# Altium schematic sheet UWB_Tag.SchDoc
size A3; SheetNumber: 1; SheetTotal: 1
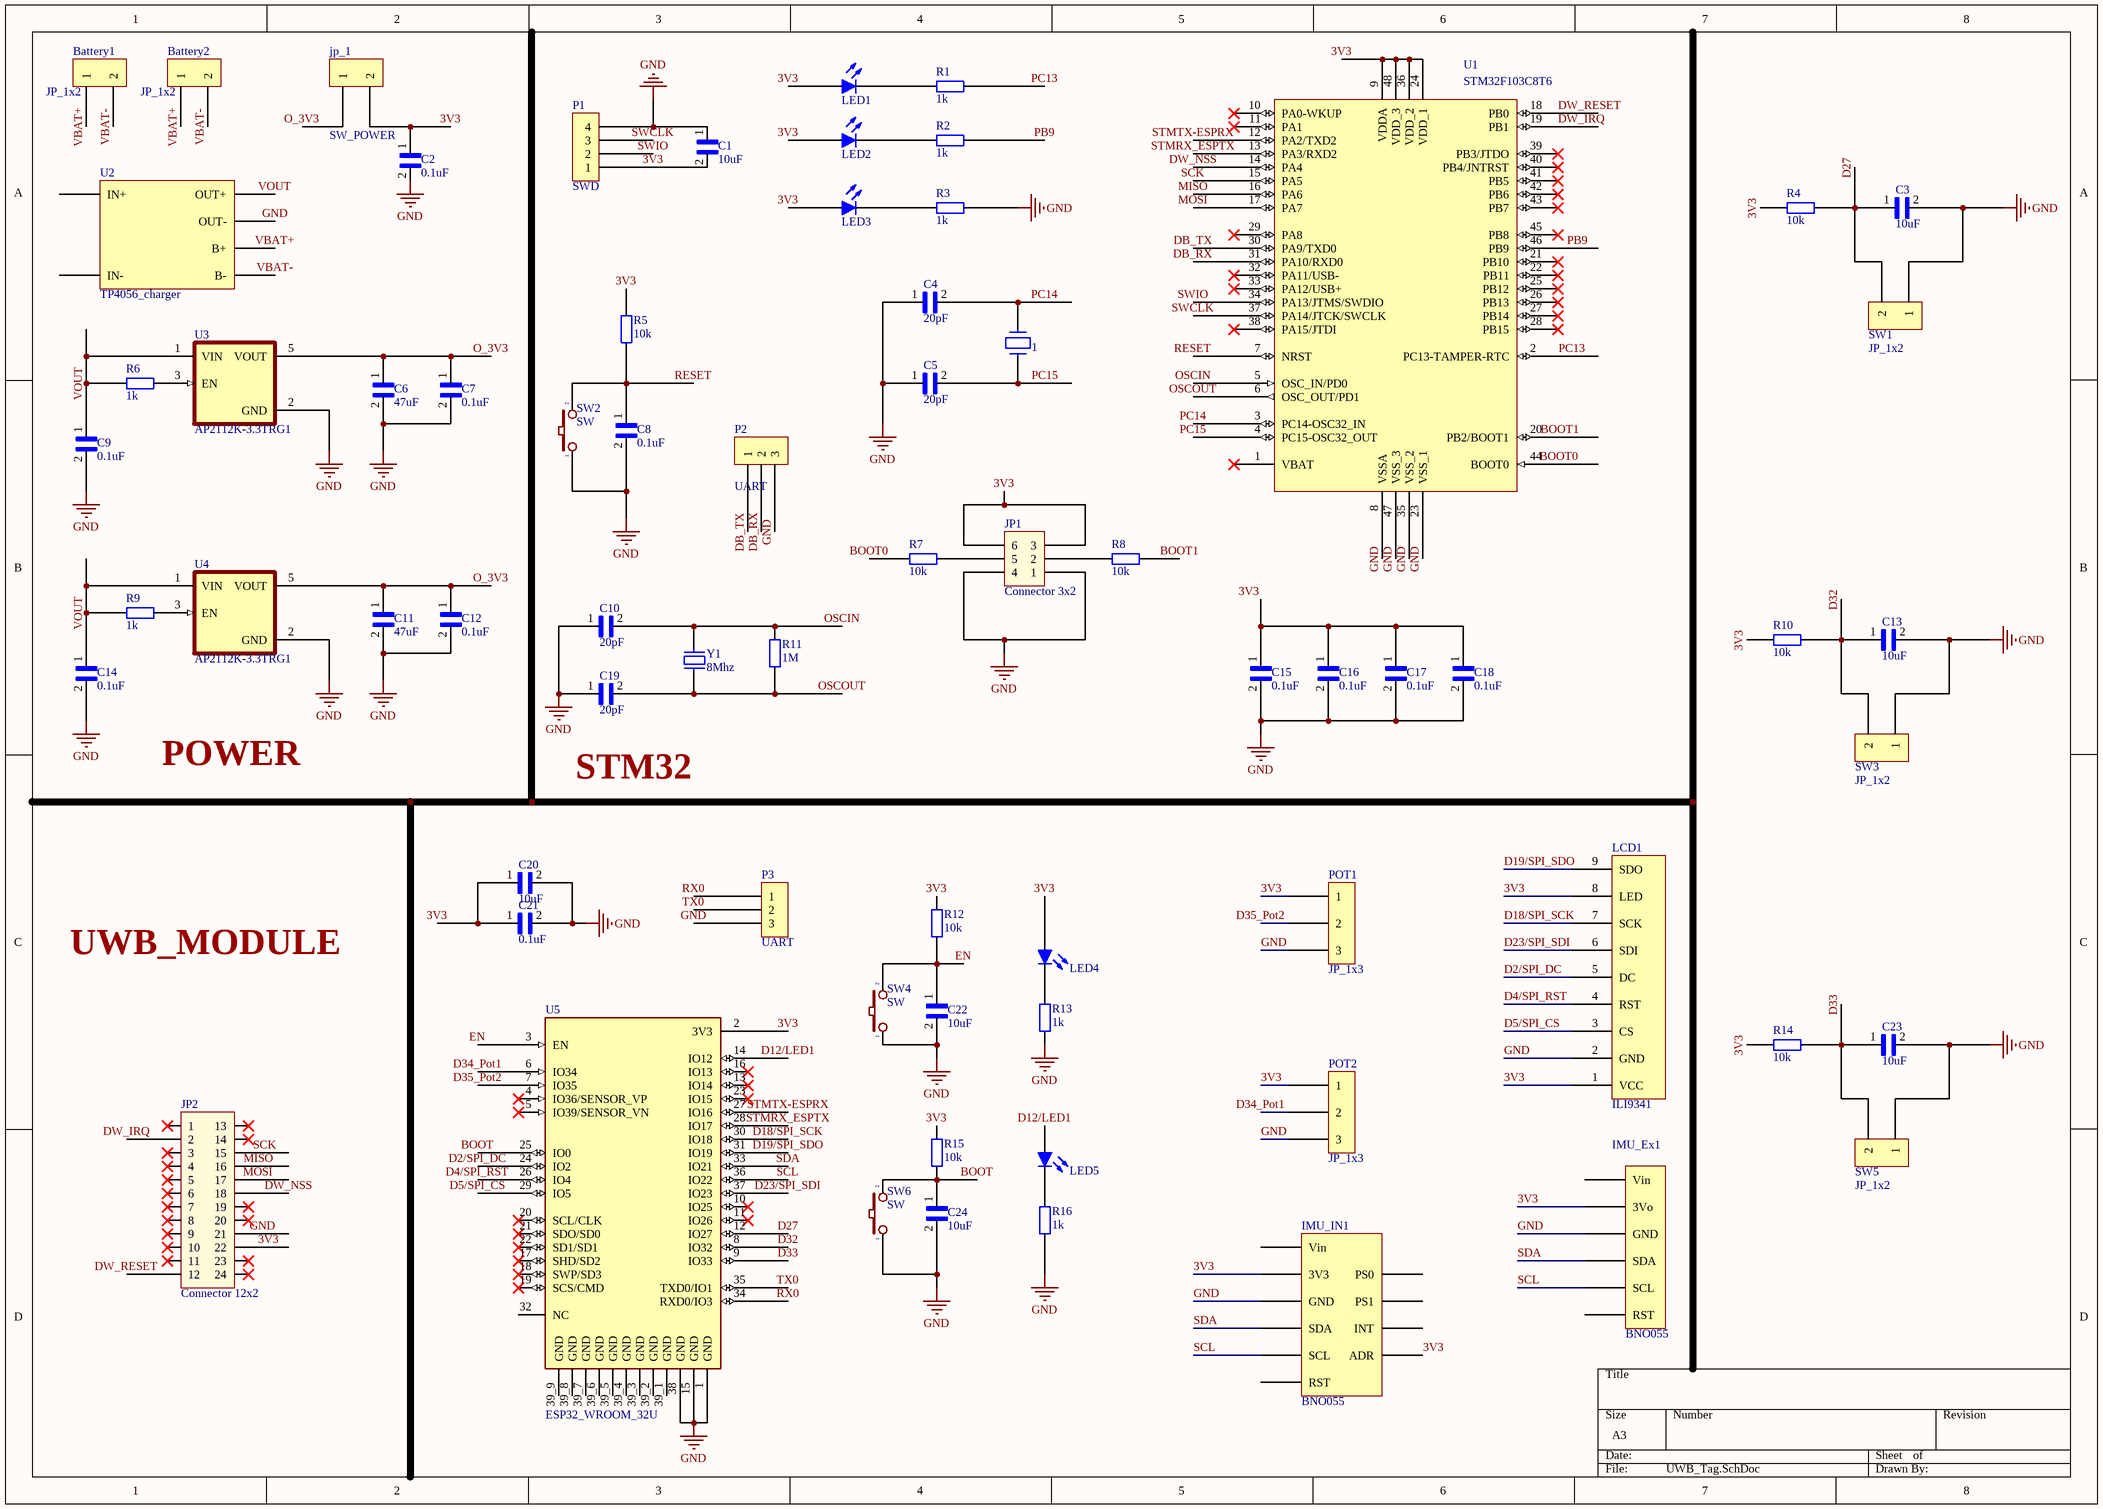
[diagram p0: UWB_Tag.SchDoc]

## Parts
1  ABS07  [ABS07]  (value not drawn)
Battery1  JP_1x2  [JP_1x2]
Battery2  JP_1x2  [JP_1x2]
C1  10uF  [Capacitor_0805]
C2  0.1uF  [Capacitor_0805]
C3  10uF  [Capacitor_0805]
C4  20pF  [Capacitor_0805]
C5  20pF  [Capacitor_0805]
C6  47uF  [Capacitor_0805]
C7  0.1uF  [Capacitor_0805]
C8  0.1uF  [Capacitor_0805]
C9  0.1uF  [Capacitor_0805]
C10  20pF  [Capacitor_0805]
C11  47uF  [Capacitor_0805]
C12  0.1uF  [Capacitor_0805]
C13  10uF  [Capacitor_0805]
C14  0.1uF  [Capacitor_0805]
C15  0.1uF  [Capacitor_0805]
C16  0.1uF  [Capacitor_0805]
C17  0.1uF  [Capacitor_0805]
C18  0.1uF  [Capacitor_0805]
C19  20pF  [Capacitor_0805]
C20  10uF  [Capacitor_0805]
C21  0.1uF  [Capacitor_0805]
C22  10uF  [Capacitor_0805]
C23  10uF  [Capacitor_0805]
C24  10uF  [Capacitor_0805]
IMU_Ex1  BNO055  [BNO055_External]
IMU_IN1  BNO055  [BNO055_Internal]
JP1  Connector 3x2  [JP3x2]
JP2  Connector 12x2  [JP12X2_1]
jp_1  SW_POWER  [JP_1x2]
LCD1  ILI9341  [ILI9341_LCD3.5]
LED1  Led  [Led 0805 Blue]  (value not drawn)
LED2  Led  [Led 0805 Blue]  (value not drawn)
LED3  Led  [Led 0805 Blue]  (value not drawn)
LED4  Led  [Led 0805 Blue]  (value not drawn)
LED5  Led  [Led 0805 Blue]  (value not drawn)
P1  SWD  [HDR/Header/4/BOX]
P2  UART  [HDR/Header/3/BOX]
P3  UART  [HDR/Header/3/BOX]
POT1  JP_1x3  [JP_1x3]
POT2  JP_1x3  [JP_1x3]
R1  1k  [tro smd 0805]
R2  1k  [tro smd 0805]
R3  1k  [tro smd 0805]
R4  10k  [tro smd 0805]
R5  10k  [tro smd 0805]
R6  1k  [tro smd 0805]
R7  10k  [tro smd 0805]
R8  10k  [tro smd 0805]
R9  1k  [tro smd 0805]
R10  10k  [tro smd 0805]
R11  1M  [tro smd 0805]
R12  10k  [tro smd 0805]
R13  1k  [tro smd 0805]
R14  10k  [tro smd 0805]
R15  10k  [tro smd 0805]
R16  1k  [tro smd 0805]
SW1  JP_1x2  [JP_1x2]
SW2  SW  [SW1-SMD]
SW3  JP_1x2  [JP_1x2]
SW4  SW  [SW1-SMD]
SW5  JP_1x2  [JP_1x2]
SW6  SW  [SW1-SMD]
U1  STM32F103C8T6  [LQFP48]
U2  TP4056_charger  [TP4056_charger]
U3  AP2112K-3.3TRG1  [SOT95P285X140-5N]
U4  AP2112K-3.3TRG1  [SOT95P285X140-5N]
U5  ESP32_WROOM_32U  [ESP32_WROOM_32U]
Y1  8Mhz  [Thach Anh 2 chan SMD5032]

## Nets
GND: C1.1 C2.2 C3.2 C4.1 C5.1 C6.2 C7.2 C8.2 C9.2 C10.1 C11.2 C12.2 C13.2 C14.2 C15.2 C16.2 C17.2 C18.2 C19.1 C20.2 C21.2 C22.2 C23.2 C24.2 IMU_Ex1.3(GND) IMU_IN1.3(GND) JP1.1 JP1.4 JP2.21 LCD1.2(GND) P1.4 P2.3 P3.3 POT1.3 POT2.3 R3.2 R13.2 R16.2 SW1.1 SW2.1 SW3.1 SW4.1 SW5.1 SW6.1 U1.8(VSSA) U1.23(VSS_1) U1.35(VSS_2) U1.47(VSS_3) U2.4(OUT-) U3.2(GND) U4.2(GND) U5.1(GND) U5.15(GND) U5.38(GND)
3V3: C1.2 C2.1 C15.1 C16.1 C17.1 C18.1 C20.1 C21.1 IMU_Ex1.2(3Vo) IMU_IN1.2(3V3) IMU_IN1.7(ADR) JP1.3 JP1.6 JP2.22 jp_1.2 LCD1.1(VCC) LCD1.8(LED) LED1.1(A) LED2.1(A) LED3.1(A) LED4.1(A) P1.1 POT1.1 POT2.1 R4.2 R5.2 R10.2 R12.2 R14.2 R15.2 U1.9(VDDA) U1.24(VDD_1) U1.36(VDD_2) U1.48(VDD_3) U5.2(3V3)
BOOT: C24.1 R15.1 SW6.2 U5.25(IO0)
BOOT0: R7.1 U1.44(BOOT0)
BOOT1: R8.2 U1.20(PB2/BOOT1)
D2/SPI_DC: LCD1.5(DC) U5.24(IO2)
D4/SPI_RST: LCD1.4(RST) U5.26(IO4)
D5/SPI_CS: LCD1.3(CS) U5.29(IO5)
D12/LED1: LED5.1(A) U5.14(IO12)
D18/SPI_SCK: LCD1.7(SCK) U5.30(IO18)
D19/SPI_SDO: LCD1.9(SDO) U5.31(IO19)
D23/SPI_SDI: LCD1.6(SDI) U5.37(IO23)
D27: C3.1 R4.1 SW1.2 U5.12(IO27)
D32: C13.1 R10.1 SW3.2 U5.8(IO32)
D33: C23.1 R14.1 SW5.2 U5.9(IO33)
D34_Pot1: POT2.2 U5.6(IO34)
D35_Pot2: POT1.2 U5.7(IO35)
DB_RX: P2.2 U1.31(PA10/RXD0)
DB_TX: P2.1 U1.30(PA9/TXD0)
DW_IRQ: JP2.2 U1.19(PB1)
DW_NSS: JP2.18 U1.14(PA4)
DW_RESET: JP2.12 U1.18(PB0)
EN: C22.1 R12.1 SW4.2 U5.3(EN)
MISO: JP2.16 U1.16(PA6)
MOSI: JP2.17 U1.17(PA7)
O_3V3: C6.1 C7.1 C11.1 C12.1 jp_1.1 U3.5(VOUT) U4.5(VOUT)
OSCIN: C10.2 R11.2 U1.5(OSC_IN/PD0) Y1.2
OSCOUT: C19.2 R11.1 U1.6(OSC_OUT/PD1) Y1.1
PB9: R2.2 U1.46(PB9)
PC13: R1.2 U1.2(PC13-TAMPER-RTC)
PC14: 1.2 C4.2 U1.3(PC14-OSC32_IN)
PC15: 1.1 C5.2 U1.4(PC15-OSC32_OUT)
RESET: C8.1 R5.1 SW2.2 U1.7(NRST)
RX0: P3.1 U5.34(RXD0/IO3)
SCK: JP2.15 U1.15(PA5)
SCL: IMU_Ex1.5(SCL) IMU_IN1.5(SCL) U5.36(IO22)
SDA: IMU_Ex1.4(SDA) IMU_IN1.4(SDA) U5.33(IO21)
STMRX_ESPTX: U1.13(PA3/RXD2) U5.28(IO17)
STMTX-ESPRX: U1.12(PA2/TXD2) U5.27(IO16)
SWCLK: P1.3 U1.37(PA14/JTCK/SWCLK)
SWIO: P1.2 U1.34(PA13/JTMS/SWDIO)
TX0: P3.2 U5.35(TXD0/IO1)
VBAT+: Battery1.1 Battery2.1 U2.1(B+)
VBAT-: Battery1.2 Battery2.2 U2.2(B-)
VOUT: C9.1 C14.1 R6.1 R9.1 U2.3(OUT+) U3.1(VIN) U4.1(VIN)
NetJP1_2: JP1.2 R8.1
NetJP1_5: JP1.5 R7.2
NetLED1_2: LED1.2(K) R1.1
NetLED2_2: LED2.2(K) R2.1
NetLED3_2: LED3.2(K) R3.1
NetLED4_2: LED4.2(K) R13.1
NetLED5_2: LED5.2(K) R16.1
NetR6_2: R6.2 U3.3(EN)
NetR9_2: R9.2 U4.3(EN)

Not connected (* = marked no-connect by the designer): IMU_Ex1 1(Vin) 6(RST); IMU_IN1 1(Vin) 6(RST) 8(INT) 9(PS1) 10(PS0); JP2 1* 3* 4* 5* 6* 7* 8* 9* 10* 11* 13* 14* 19* 20* 23* 24*; U1 1(VBAT)* 10(PA0-WKUP)* 11(PA1)* 21(PB10)* 22(PB11)* 25(PB12)* 26(PB13)* 27(PB14)* 28(PB15)* 29(PA8)* 32(PA11/USB-)* 33(PA12/USB+)* 38(PA15/JTDI)* 39(PB3/JTDO)* 40(PB4/JNTRST)* 41(PB5)* 42(PB6)* 43(PB7)* 45(PB8)*; U2 5(IN+) 6(IN-); U5 4(IO36/SENSOR_VP)* 5(IO39/SENSOR_VN)* 10(IO25)* 11(IO26)* 13(IO14)* 16(IO13)* 17(SHD/SD2)* 18(SWP/SD3)* 19(SCS/CMD)* 20(SCL/CLK)* 21(SDO/SD0)* 22(SD1/SD1)* 23(IO15)* 32(NC) 39_1(GND) 39_2(GND) 39_3(GND) 39_4(GND) 39_5(GND) 39_6(GND) 39_7(GND) 39_8(GND) 39_9(GND)

## Notes on the sheet
- POWER
- STM32
- UWB_MODULE

## Library data of the parts
1 = ABS07: SMD Quartz Crystal; Created By: Zion Blue; Published: 28 April 2014; Publisher: Cynetik Group
C1-C24 = Capacitor_0805: Capacitor; Ceramic; Cap; .220uF; Tol 10%; SMT; Vol-Rtg 50V; X7R; Tape And Reel
IMU_Ex1 = BNO055_External
JP1 = JP3x2: Value: Connector 3x2
JP2 = JP12x2: Value: Connector 12x2
jp_1 = JP_1x2
LCD1 = ILI9341_LCD3.5
LED1-LED5 = Led: Typical LED
P1 = Header 4_1: Header, 4-Pin
P2 P3 = Header 3: Header, 3-Pin
R1-R3 R6 R9 R13 R16 = Tro 0805 1% 1k: Dán; Don_Vi: Con; So_Chan: 2; Ten_Linh_Kien: Trở 0805 1% 1k; Ma_Hang: MH005468; Chung_Loai: Dán; Kieu_Chan: *
R4 R5 R7 R8 R10 R12 R14 R15 = Tro 0805 1% 10k: Dán; Don_Vi: Con; So_Chan: 2; Ten_Linh_Kien: Trở 0805 1% 10k; Ma_Hang: MH005473; Chung_Loai: Dán; Kieu_Chan: *
R11 = Tro 0805 1% 1M: Dán; Don_Vi: Con; So_Chan: 2; Ten_Linh_Kien: Trở 0805 1% 1M; Ma_Hang: MH005469; Chung_Loai: Dán; Kieu_Chan: *
SW2 SW4 SW6 = SW2: Switch button 2 pin; Value: SW chip 2 pin
U1 = STM32F103C8T6: STM32 ARM-based 32-bit MCU with ARM 32-bit Cortex-M3 Microcontroller, 128 Kbytes Flash, 48-pin LQFP, Industrial Temperature; Published: 30-May-2008; DatasheetVersion: rev6, Mar-2008; PackageVersion: Mar-2008; PackageReference: LQFP48; Publisher: Altium Limited; PackageDescription: 48-Pin Low-Profile Quad Flat Pack, 7 x 7 mm Body, 0.5 mm Pitch (LQFP48); ComponentLink1Description: Manufacturer Link; ComponentLink1URL: www.st.com/stm32; ComponentLink2Description: Datasheet; ComponentLink2URL: http://www.st.com/stonline/products/literature/ds/13586.pdf
U3 U4 = AP2112K-3.3TRG1: Linear Voltage Regulator IC Positive Fixed 1 Output 600mA SOT-25; MF: Diodes Inc.; Value: *; Purchase-URL: https://pricing.snapeda.com/search/part/AP2112K-3.3TRG1/?ref=eda; Package: SOT-753 Diodes Inc.; Availability: In Stock; Check_prices: https://www.snapeda.com/parts/AP2112K-3.3TRG1/Diodes+Inc./view-part/?ref=eda; Price: None; SnapEDA_Link: https://www.snapeda.com/parts/AP2112K-3.3TRG1/Diodes+Inc./view-part/?ref=snap; MP: AP2112K-3.3TRG1
U5 = ESP32_WROOM_32U: Bluetooth, WiFi 802.11b/g/n, Bluetooth v4.2 +EDR, Class 1, 2 and 3 Transceiver Module 2.4GHz ~ 2.5GHz Antenna Not Included, U.FL Surface Mount
Y1 = Thach Anh 2 chan SMD 5032: Crystal For all Crystal 2pin.; Value: 4Mhz